# EAGLE design Adafruit CC3000 shield REV-B (EAGLE 6.3)
COMPANY: ADAFRUIT INDUSTRIES; DRAWN: KTOWN; REV: C
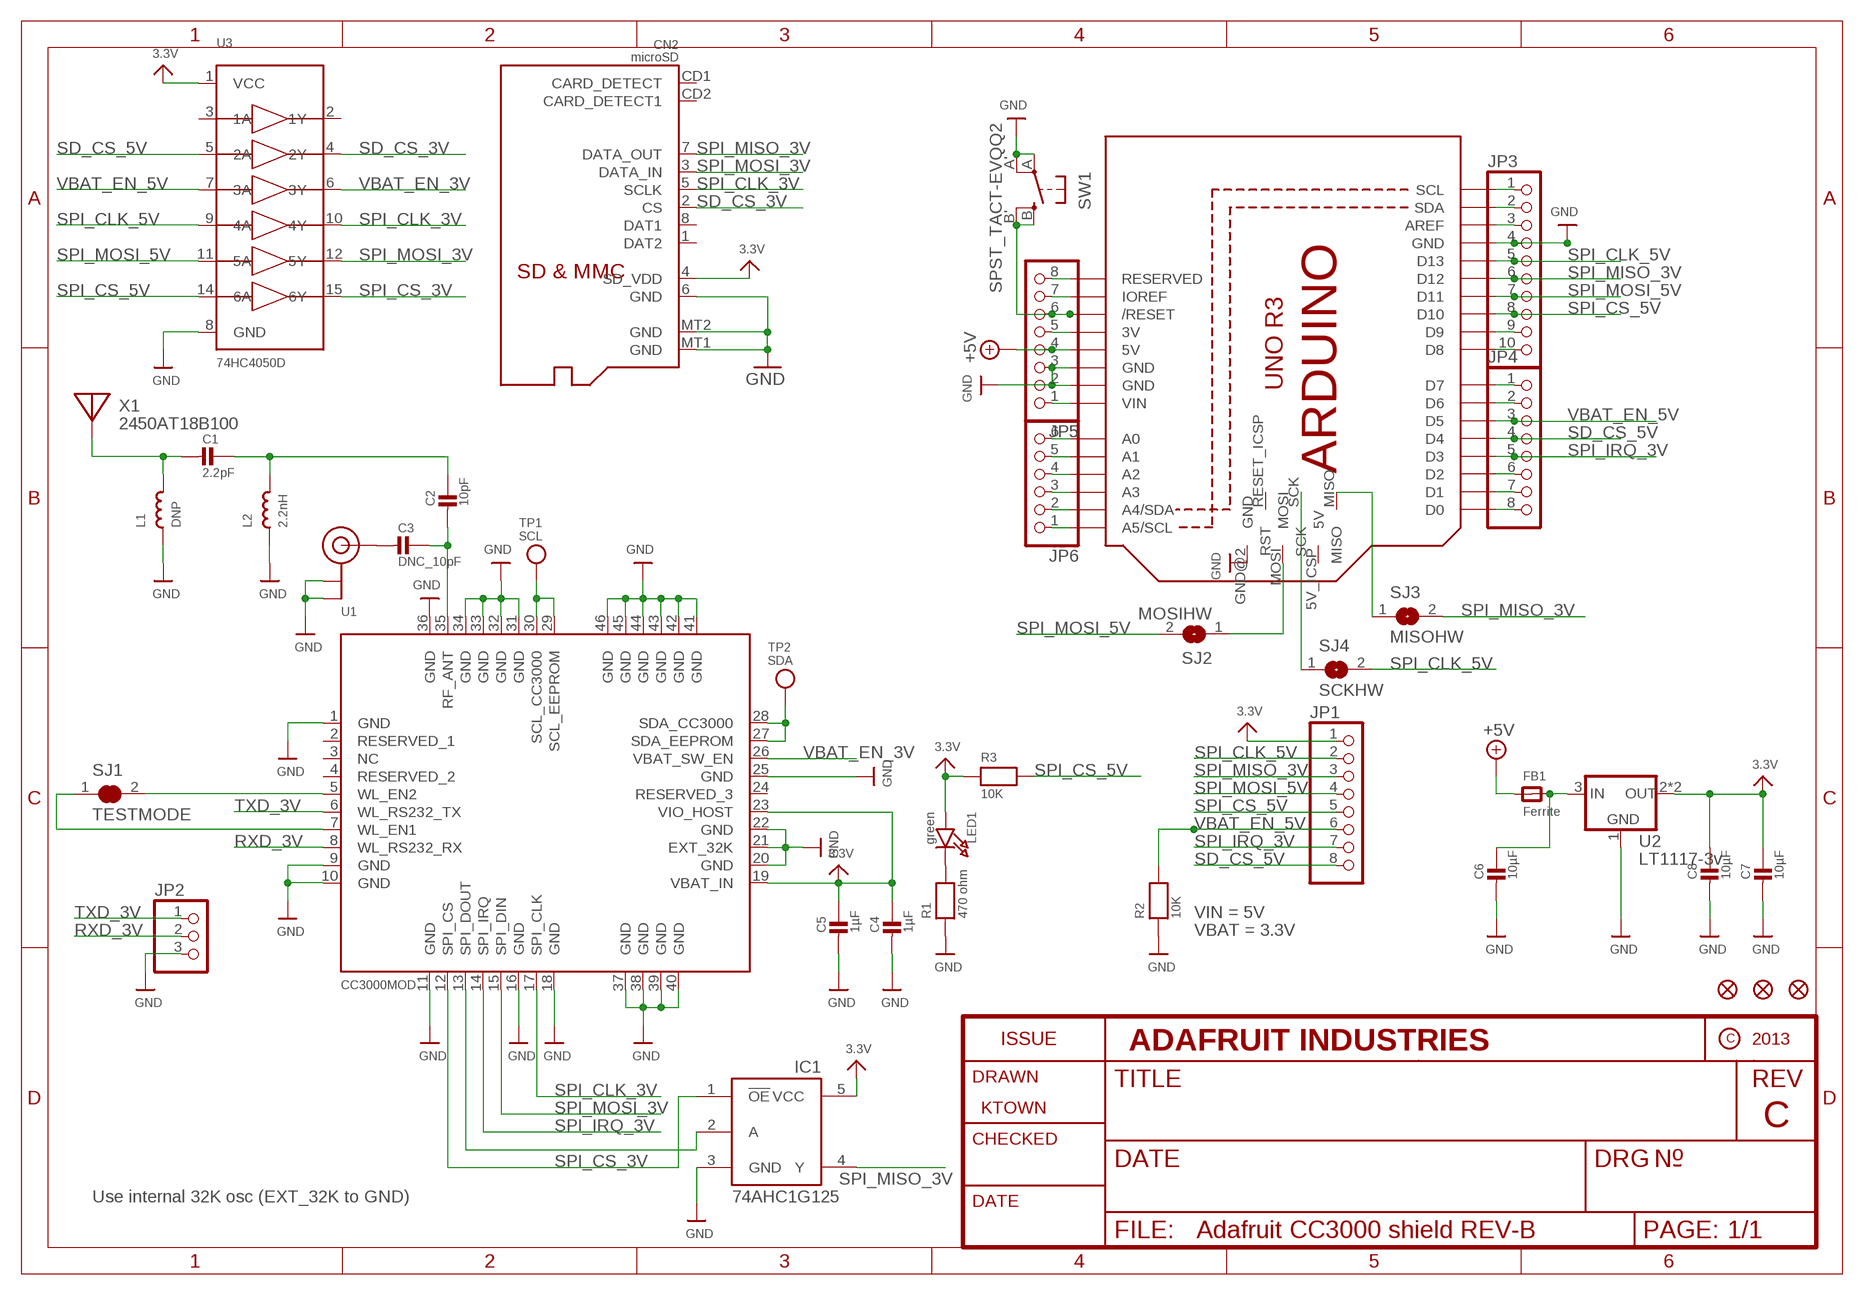
[diagram p0: schematic, sheet 1]

## Parts
C1  2.2pF  CAP_CERAMIC_0402  [_0402]
C2  10pF  CAP_CERAMIC_0402  [_0402]
C3  DNC_10pF  CAP_CERAMIC_0402  [_0402]
C4  1µF  CAP_CERAMIC_0805MP  [_0805MP]
C5  1µF  CAP_CERAMIC_0805MP  [_0805MP]
C6  10µF  CAP_CERAMIC_0805MP  [_0805MP]
C7  10µF  CAP_CERAMIC_0805MP  [_0805MP]
C8  10µF  CAP_CERAMIC_0805MP  [_0805MP]
CN2  microSD  MICROSD  [MICROSD]
FB1  Ferrite  FERRITE_0805MP  [_0805MP]
FID1  FIDUCIAL""  [FIDUCIAL_1MM]
FID2  FIDUCIAL""  [FIDUCIAL_1MM]
FID3  FIDUCIAL""  [FIDUCIAL_1MM]
IC1  74AHC1G125  [SOT23-5L]
JP1  PINHD-1X8BIG  [1X08-BIG]
JP2  HEADER-1X3ROUND  [1X03_ROUND]
JP3  HEADER-1X1070MIL  [1X10_ROUND70]
JP4  PINHD-1X8CLEANBIG  [1X08-CLEANBIG]
JP5  PINHD-1X8CLEANBIG  [1X08-CLEANBIG]
JP6  PINHD-1X6CB  [1X06-CLEANBIG]
L1  DNP  INDUCTOR_0402  [_0402]
L2  2.2nH  INDUCTOR_0402  [_0402]
LED1  green  LED0805_NOOUTLINE  [CHIPLED_0805_NOOUTLINE]
R1  470 ohm  RESISTOR_0805MP  [_0805MP]
R2  10K  RESISTOR_0805MP  [_0805MP]
R3  10K  RESISTOR_0805MP  [_0805MP]
SJ1  TESTMODE  SOLDERJUMPER_CLOSED  [SOLDERJUMPER_CLOSEDWIRE]
SJ2  MOSIHW  SOLDERJUMPER  [SOLDERJUMPER_ARROW_NOPASTE]
SJ3  MISOHW  SOLDERJUMPER  [SOLDERJUMPER_ARROW_NOPASTE]
SJ4  SCKHW  SOLDERJUMPER  [SOLDERJUMPER_ARROW_NOPASTE]
SW1  SPST_TACT-EVQQ2  [EVQ-Q2]
TP1  SCL  TESTPOINTPAD1MM  [TESTPOINT_PAD_1MM]
TP2  SDA  TESTPOINTPAD1MM  [TESTPOINT_PAD_1MM]
U1  CC3000MOD  [CC3000MOD]
U2  LT1117-3v  VREG_SOT223  [SOT223-R]
U3  74HC4050D  [SOIC16]
U$35  U.FL  [U.FL]
U$36  ARDUINO_R3_ICSP  [ARDUINOR3_ICSP]
X1  2450AT18B100  ANTENNA_JOHANSON_2500AT44M0400  [ANT_2500AT44M0400]

## Nets
3.3V: C4.1 C5.1 C7.1 C8.1 CN2.4(SD_VDD) IC1.5(VCC) JP1.1 LED1.A R3.1 U1.19(VBAT_IN) U1.23(VIO_HOST) U2.2(OUT) U2.4(OUT) U3.1(VCC)
+5V: FB1.1 JP5.4 U$36.5V
GND: C4.2 C5.2 C6.2 C7.2 C8.2 CN2.6(GND) CN2.MT1(GND) CN2.MT2(GND) IC1.3(GND) JP2.3 JP3.4 JP5.2 JP5.3 L1.1 L2.1 R1.1 R2.1 SW1.A'(P1) SW1.A(P) U1.1(GND) U1.9(GND) U1.10(GND) U1.11(GND) U1.16(GND) U1.18(GND) U1.20(GND) U1.21(EXT_32K) U1.22(GND) U1.25(GND) U1.31(GND) U1.32(GND) U1.33(GND) U1.34(GND) U1.36(GND) U1.37(GND) U1.38(GND) U1.39(GND) U1.40(GND) U1.41(GND) U1.42(GND) U1.43(GND) U1.44(GND) U1.45(GND) U1.46(GND) U2.1(GND) U3.8(GND) U$35.P$1(GND) U$35.P$2(GND) U$36.GND U$36.GND@1(GND) U$36.GND@2(GND) U$36.GND@3(GND)
N$1: C1.2 L1.2 X1.FEED
N$2: C1.1 C2.1 L2.2
N$3: C3.2 U$35.P$3(SIGNAL)
N$4: C2.2 C3.1 U1.35(RF_ANT)
N$5: SJ1.2 U1.5(WL_EN2)
N$6: SJ1.1 U1.7(WL_EN1)
N$7: JP3.1 U$36.SCL
N$8: JP3.2 U$36.SDA
N$9: C6.1 FB1.2 U2.3(IN)
N$10: JP3.3 U$36.AREF
N$11: JP5.6 SW1.B'(S1) SW1.B(S) U$36.RESET(/RESET)
N$12: IC1.2(A) U1.13(SPI_DOUT)
N$16: JP3.9 U$36.D9
N$17: JP3.10 U$36.D8
N$18: JP4.1 U$36.D7
N$19: JP4.2 U$36.D6
N$23: JP4.6 U$36.D2
N$24: JP4.7 U$36.D1
N$25: JP4.8 U$36.D0
N$26: JP5.1 U$36.VIN
N$27: JP5.5 U$36.3V
N$29: JP5.7 U$36.IOREF
N$30: JP5.8 U$36.RESERVED
N$31: JP6.1 U$36.A5(A5/SCL)
N$32: JP6.2 U$36.A4(A4/SDA)
N$33: JP6.3 U$36.A3
N$34: JP6.4 U$36.A2
N$35: JP6.5 U$36.A1
N$36: JP6.6 U$36.A0
N$53: LED1.C R1.2
N$161: SJ2.1 U$36.MOSI
N$163: SJ4.1 U$36.SCK
N$164: SJ3.1 U$36.MISO
RXD_3V: JP2.2 U1.8(WL_RS232_RX)
SCL_3V: TP1.P$1 U1.29(SCL_EEPROM) U1.30(SCL_CC3000)
SD_CS_3V: CN2.2(CS) U3.4(2Y)
SD_CS_5V: JP1.8 JP4.4 U3.5(2A) U$36.D4
SDA_3V: TP2.P$1 U1.27(SDA_EEPROM) U1.28(SDA_CC3000)
SPI_CLK_3V: CN2.5(SCLK) U1.17(SPI_CLK) U3.10(4Y)
SPI_CLK_5V: JP1.2 JP3.5 SJ4.2 U3.9(4A) U$36.D13
SPI_CS_3V: IC1.1(!OE) U1.12(SPI_CS) U3.15(6Y)
SPI_CS_5V: JP1.5 JP3.8 R3.2 U3.14(6A) U$36.D10
SPI_IRQ_3V: JP1.7 JP4.5 U1.14(SPI_IRQ) U$36.D3
SPI_MISO_3V: CN2.7(DATA_OUT) IC1.4(Y) JP1.3 JP3.6 SJ3.2 U$36.D12
SPI_MOSI_3V: CN2.3(DATA_IN) U1.15(SPI_DIN) U3.12(5Y)
SPI_MOSI_5V: JP1.4 JP3.7 SJ2.2 U3.11(5A) U$36.D11
TXD_3V: JP2.1 U1.6(WL_RS232_TX)
VBAT_EN_3V: U1.26(VBAT_SW_EN) U3.6(3Y)
VBAT_EN_5V: JP1.6 JP4.3 R2.2 U3.7(3A) U$36.D5
Unconnected: CN2.1(DAT2) CN2.8(DAT1) CN2.CD1(CARD_DETECT) CN2.CD2(CARD_DETECT1) U1.2(RESERVED_1) U1.3(NC) U1.4(RESERVED_2) U1.24(RESERVED_3) U3.2(1Y) U3.3(1A) U$36.5V_ICSP(5V) U$36.RESET_ICSP(RST)

## Notes on the sheet
- VIN = 5V
- VBAT = 3.3V
- Use internal 32K osc (EXT_32K to GND)

## Library data of the parts
C1-C8 = microbuilder:CAP_CERAMIC: Ceramic Capacitors For new designs, use the packages preceded by an '_' character since they are more reliable: The following footprints should be used on most boards: _0402 - Standard footprint for regular board layouts _0603 - Standard footprint for regular board layouts _0805 - Standard footprint for regular board layouts For extremely tight-pitch boards where space is at a premium, the following 'micro-pitch' footprints can be used (smaller pads, no silkscreen outline, etc.): _0402MP - Micro-pitch footprint for very dense/compact boards _0603MP - Micro-pitch footprint for very dense/compact boards _0805MP - Micro-pitch footprint for very dense/compact boards Commonly Stocked Parts 0402 - 0402 Surface Mount Capacitors 16pF 50V 5% [Digikey: 445-4899-2-ND] 18pF 50V 5% [Digikey: 490-1281-2-ND] 22pF 50V 5% [Digikey: 490-1283-2-ND] 68pF 50V 5% [Digikey: 490-1289-2-ND] 0.1uF 10V 10% [Digikey: 490-1318-2-ND] 1.0uF 6.3V 10% [Digikey: 490-1320-2-ND] 0603 - 0603 Surface Mount Capacitors 16 pF 50V 5% [Digikey: 445-5051-2-ND] 22 pF 50V [Digikey: PCC220ACVTR-ND] 33 pF 50V 5% [Digikey: 490-1415-1-ND] 56pF 50V 5% [Digikey: 490-1421-1-ND] 220pF 50V 5% [Digikey: 445-1285-1-ND] 680 pF 50V 2200 pF 50V 5% C0G [Digikey: 445-1297-1-ND] 5600 pF 100V 5% X7R [Digikey: 478-3711-1-ND] 0.1 µF 25V 10% [Digikey: PCC2277TR-ND] 0.22 µF 16V 10% X7R [Digikey: 445-1318-1-ND] 1.0 µF 25V 10% [Digikey: 445-5146-2-ND] 0603 - RF Specific 3pF 250V +/-0.1pF RF [Digikey: 712-1347-1-ND] 18 pF 250V 5% [Digikey: 478-3505-1-ND or 712-1322-1-ND] 56 pF 250V 5% C0G RF [Digikey: 490-4867-1-ND] 68 pF 250V RF [Digikey: 490-4868-1-ND] 0805 - 0805 Surface Mount Capacitors 220 pF 250V 2% RF Ceramic Capacitor [Digikey: 712-1398-1-ND] 1000 pF 50V 2% NP0 Ceramic Capacitor [Digikey: 478-3760-1-ND] 0.1 µF 25V 10% Ceramic Capacitor [Digikey: PCC1828TR-ND] 1.0 µF 16V 10% Ceramic Capacitor[Digikey: 490-1691-2-ND] 10.0 µF 10V 10% Ceramic Capacitor[Digikey: 709-1228-1-ND] 10.0 uF 16V 10% Ceramic Capacitor [Digikey: 478-5165-2-ND] 47 uF 6.3V 20% Ceramic Capacitor [Digikey: 587-1779-1-ND or 399-5506-1-ND] 1206 - 1206 Surface Mount Capacitors 47uF 10V 20% Ceramic Capacitor [Digikey: 490-5528-1-ND or 399-5508-1-ND or 445-6010-1-ND] 100uF 6.3V -20%, +80% Y5V Ceramic Capacitor (Digikey: 490-4512-1-ND, Mouser: 81-GRM31CF50J107ZE1L)
CN2 = microbuilder:MICROSD: MicroSD/Transflash Card Holder with SPI pinout 3M: 2908-05WB-MG 4UConnector: 19656 Footprint courtesy: Adafruit Industries
FB1 = microbuilder:FERRITE: Ferrite Bead 0603 MMZ1608B121C - 120 Ohm @ 100MHz, 600mA, 0.15 Ohm DC Resistance - Digikey: 445-2164-1-ND BK1608HW121-T - 120 Ohm, 600mA Ferrite Chip - Digikey: 587-1876-2-ND 0805 HZ0805B272R-10 - 2.7K Ohm @ 100MHz, 200mA, 0.8 Ohm DC Resistance - Digikey: 240-2504-1-ND (see also Murata BLM21BD272SN1L) MMZ2012Y152B - 1.5K Ohm @ 100MHz, 500mA, 0.4 Ohm DC Resistance - Digikey: 445-1560-1-ND - Mainly for high frequency (80-400MHz) MMZ2012R102A - 1K Ohm @ 100MHz, 500mA, 0.3 Ohm DC Resistance - Digikey: 445-1555-2-ND - More general purpose (10-200MHz)
FID1-FID3 = microbuilder:FIDUCIAL: Fiducial Alignment Points Various fiducial points for machine vision alignment.; BOM: EXCLUDE
IC1 = adafruit:74AHC1G125
JP1 JP4 JP5 = adafruit:PINHD-1X8: PIN HEADER
JP2 = microbuilder:HEADER-1X3: PIN HEADER
JP3 = microbuilder:HEADER-1X10: PIN HEADER
JP6 = adafruit:PINHD-1X6: PIN HEADER
L1 L2 = microbuilder:INDUCTOR: Inductors 0603: 10nH Ceramic Inductor - microwire antenna/RF (Digikey: 712-1434-2-ND) 0805: 560nH Ceramic Inductor - RF (Digikey: 553-1047-1-ND) 270nH Ceramic Inductor - Q = 40@250MHz, +-5%, 1 Ohm DC Resistance (Digikey: 535-10506-2-ND) 1007 (2518 Metric) SMT: 10µH 10% 250mOhm 820mA 1007 Inductor (Digikey: 587-2189-1-ND) 22µH 10% 500mOhm 580mA 1007 Inductor (Digikey: 587-2190-1-ND) 47µH 10% 950mOhm 420mA 1007 Inductor (Digikey: 587-2191-1-ND) 47µH 5% 100mOhm 1A 1008 Inductor (Digikey: 732-1816-1-ND) 5.0x5.0mm (Taiyo Yuden NR5040 Series) 6.8µH 20% 2.3A 64mOhm Inductor (Digikey: 587-2374-2-ND) 5.0x5.0mm (TDK VLC5045 Series) 4.7µH 20% 3.3A 34mOhm Inductor (Digikey: 445-6526-1-ND) 6.8µH 20% 2.7A 46mOhm Inductor (Digikey: 445-6527-1-ND) 6.0x6.0mm (TDK VLC6045 Series) 4.7µH 20% 3.8A 27mOhm Inductor (Digikey: 445-6538-2-ND) 6.8µH 20% 3A 41mOhm Inductor (Digikey: 445-6540-1-ND) 6.2µH 30% 2.2A 45mOhm Inductor (Digikey: SRR5028-6R2YCT-ND) - Not TDK VLC6045 but footprint should match 6.0x6.0mm (TDK SLF6045 Series) 6.8uH 30% 2A 33mOhm Inductor (Digikey: 445-4572-1-ND, Mouser: 810-SLF645T6R8N2R0PF) 6.0x6.0mm (Sumida CDRH5D28 Series) 6.2uH 30% 1.8A 45mOhm Inductor (Digikey: 308-1542-1-ND) Taiyo Yuden NR3015T2R2M - 2.2uH 20% 1.5A (Digikey: 587-1648-2-ND, Mouser: 963-NR3015T2R2M) - Used with TI TPS62172 CoilCraft RFID Transponder Coil - MA5532-AE (For use with AS3935 Lightning Sensor)
LED1 = microbuilder:LED: LED 0603 - 0603 Surface Mount Package 2mA: Green LED - Low Power (3.9mcd, 2ma, 1.7Vf) - Digikey: 475-2709-2-ND Orange LED - Low Power (9.8mcd, 2ma, 1.8Vf) - Digikey: 475-1194-2-ND Red LED - Low Power (5mcd, 2ma, 1.8Vf) - Digikey: 475-1195-2-ND Yellow LED - Low Power (7mcd, 2ma, 1.8Vf) - Digikey: 475-1196-2-ND 5mA: Blue LED - Low Power (17mcd, 5ma, 2.9Vf) - Digikey: LNJ937W8CRACT-ND 0805 - 0805 Surface Mount Package 2mA: Red LED (8.8mcd, 2mA, 1.8Vf, Clear) - Low Power [Digikey: 475-2510-1-ND] Green LED (5mcd, 2mA, 1.8Vf, Clear) - Low Power [Digikey: 475-2730-1-ND] Yellow LED (11.3mcd, 2mA, 1.8Vf, Clear) - Low Power [Digikey: 475-2555-1-ND] 20mA: Red LED (104mcd, 20mA, Diffused) - LS R976 [Digikey: 475-1278-6-ND] Red LED (12mcd, 20mA, 2.0Vf, Clear) - APT2012EC [Digikey: 754-1128-1-ND] Green LED (15mcd, 20mA, 2.2Vf, Clear) - APT2012GC [Digikey: 754-1131-1-ND] Orange LED (160mcd, 20mA, 2.1Vf, Clear) - APT2012SECK [Digikey: 754-1130-1-ND] 1206 - 1206 Surface Mount Package Green LED (26mcd, 20mA, Diffused) - LG N971 [Digikey: 475-1407-6-ND] Red LED (15mcd, 20mA, Diffused) - LH N974 [Digikey: 475-1416-6-ND] Cree - Cree High-Power Surface Mount LEDs XPEBWT-L1-0000-00D50 - White 111lm 350mA 2.9Vf 6200K 110° XTEAWT-00-0000-00000LEE3 - White 114lm 350mA 2.85Vf 5000K 115° Everlight - Everlight 45-21 Series Surface Mount LEDs 45-21/QK2C-B2832AC2CB2/2T - Warm White 2000mcd 20mA 3.25Vf 3050K 120° 45-21/LK2C-B38452C4CB2/2T - Nuetral White 2000mcd 20mA 3.25Vf 4150K 120° 45-21/LK2C-B50634C6CB2/2T - Cold White 2200mcd 20mA 3.25Vf 5650K 120° PLCC2 Reverse Mount LS T77K-J1L2-1-0-2-R18-Z - Red 11.25mcd 2mA 1.8Vf 630nm 120° LO T77K-L1M2-24-Z - Orange 19.6mcd 2mA 1.8Vf 606nm 120° LY T77K-K2M1-26-Z - Yellow 15.7mcd 2mA 1.8Vf 587nm 120°
R1-R3 = microbuilder:RESISTOR: Resistors For new designs, use the packages preceded by an '_' character since they are more reliable: The following footprints should be used on most boards: _0402 - Standard footprint for regular board layouts _0603 - Standard footprint for regular board layouts _0805 - Standard footprint for regular board layouts For extremely tight-pitch boards where space is at a premium, the following 'micro-pitch' footprints can be used (smaller pads, no silkscreen outline, etc.): _0402MP - Micro-pitch footprint for very dense/compact boards _0603MP - Micro-pitch footprint for very dense/compact boards _0805MP - Micro-pitch footprint for very dense/compact boards
SJ1 = microbuilder:SOLDERJUMPER_CLOSED: Solder Jumper - Closed These solder jumpers are closed by default CLOSEDWIRE - 10 mil trace between pads that can be cut and resoldered later CLOSEDPERM - 63 mil trace between pads for a permanent connection (used to 'bridge' two signals, a shameless hack for Eagle). Can double as a test point as well (no cream layer)
SJ2-SJ4 = microbuilder:SOLDERJUMPER: SMD Solder JUMPER Solder the two pads together to create a connection, or remove the solder to break it. REFLOW - Use this footprint for solder paste and reflow ovens. WAVE - Use this footprint for hand-soldering (larger pads). CLOSED - Has a trace between the two pads to ensure it is closed by default. The trace needs to be cut to disable the jumper, and can be closed again by creating a solder bridge between the two pads.; BOM: EXCLUDE
SW1 = adafruit:SPST_TACT: SMT 6mm switch, EVQQ2 series http://www.ladyada.net/library/eagle
TP1 TP2 = microbuilder:TESTPOINT: Test Point Various test points for characterisation and PCB testing TESTPOINT_SMT - Compact Surface Mount Test Point [Digikey: 5016KTR-ND]
U1 = microbuilder:CC3000MOD: CC3000MOD Wifi Module
U2 = microbuilder:VREG_SOT223: SOT-223 Fixed Voltage Regulators Part Current Out V Out V In V Dropout θJA (°C/W) TJ (°C) Operating Temp Digikey Part No. AP1117 1A 3.3V 18V 1.1V@500mA, 1.3V@1A 107°C/W 150°C -40°C-125°C AP1117IE33G-13DICT-ND Max operating temp can be calculated using θJA, TJ (max junction temperature), and power in watts. Set the "Maximum Ambient Temperature" until it reaches TJ ("Max Junction Temperature"), which is the absolute limit for safe use of the regulator: Heat Sink Temperature Calculator <http://www.daycounter.com/Calculators/Heat-Sink-Temperature-Calculator.phtml> For example, With 12V source into a 3.3V LP2985 and a 30mA load, we are dissipating (12V-3.3V) * 0.03A = 0.261W. With a θJA of 206 °C/W, a TJ of 150°C, and 261mW we can safely use the chip without a heat sink up to 75°C (=147.1°C Junction Temperature).
U3 = microbuilder:74HC4050D: 6-channel level shifter 74HC4050D - 2V-6V Supply SOIC16 Digikey: 74HC4050D,653-ND Mouser: 771-74HC4050D-T TSSOP16 Digikey: 296-9215-1-ND Mouser:
U$35 = microbuilder:U.FL: U.FL Antenna Connector
U$36 = adafruit:ARDUINO_R3_ICSP
X1 = microbuilder:ANTENNA_JOHANSON_2500AT44M0400: Johanson 2.3-2.7 GHz Chip Antenna Frequency Range: 2400 - 2500 Mhz Peak Gain 2.5 dBi typ. (XZ-V) Average Gain 0.5 dBi typ. (XZ-V) Input Power 3W max. Operating Temperature -40 to +85°C Digikey: 712-1403-1-ND Mouser: 609-2500AT44M0400E

## Board
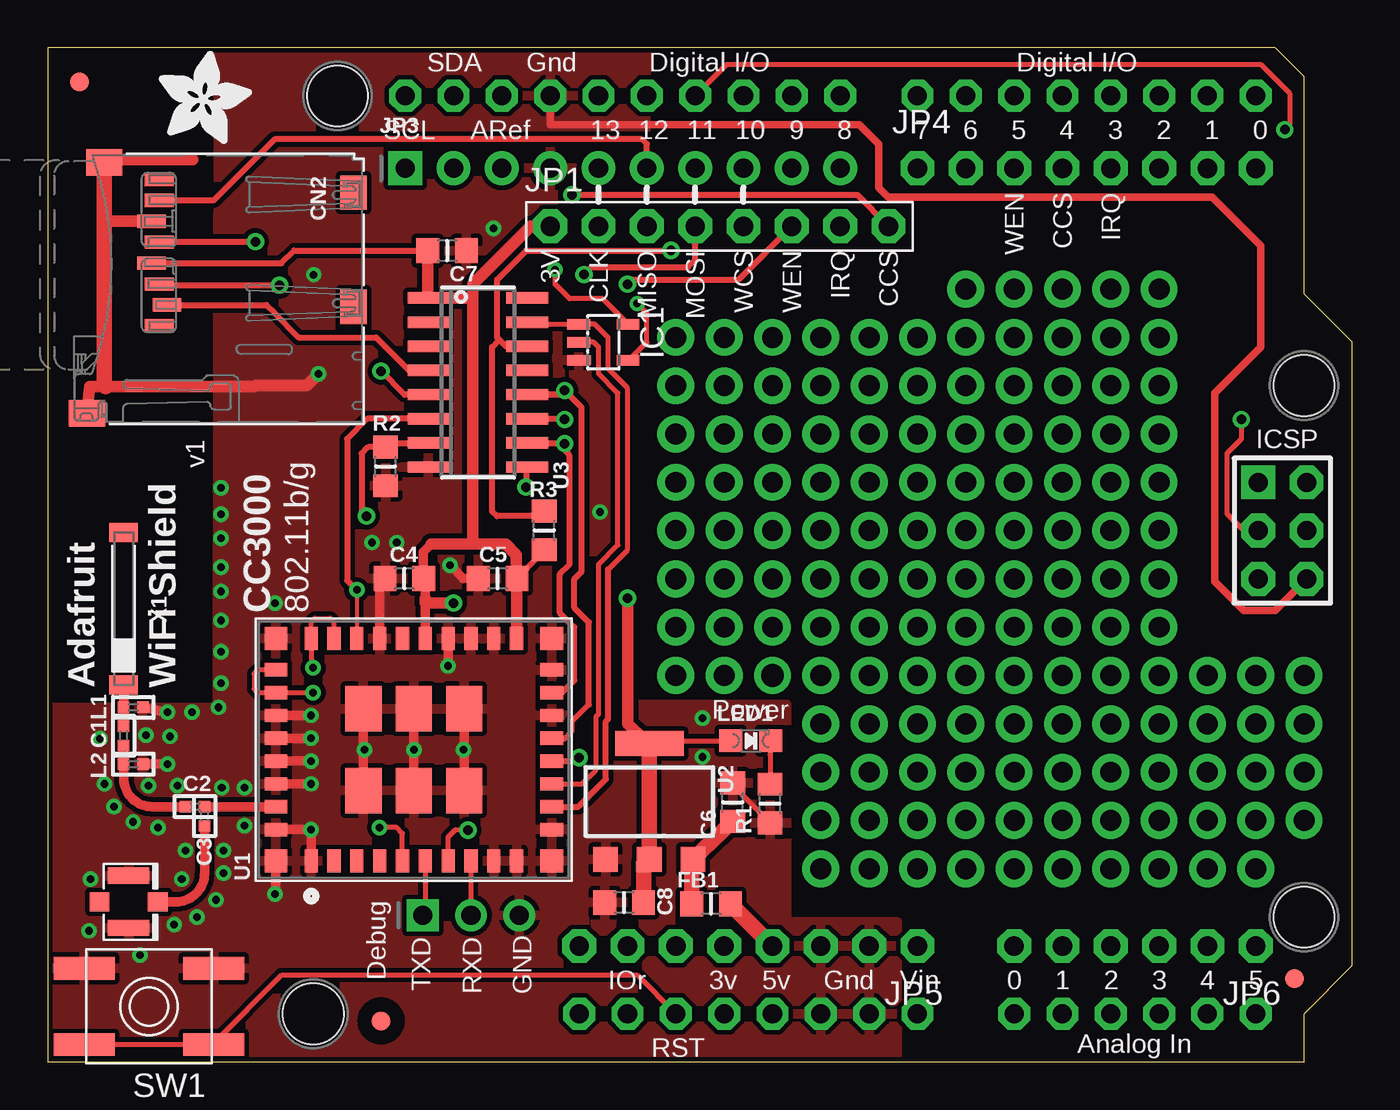
[diagram p1: board, top side]
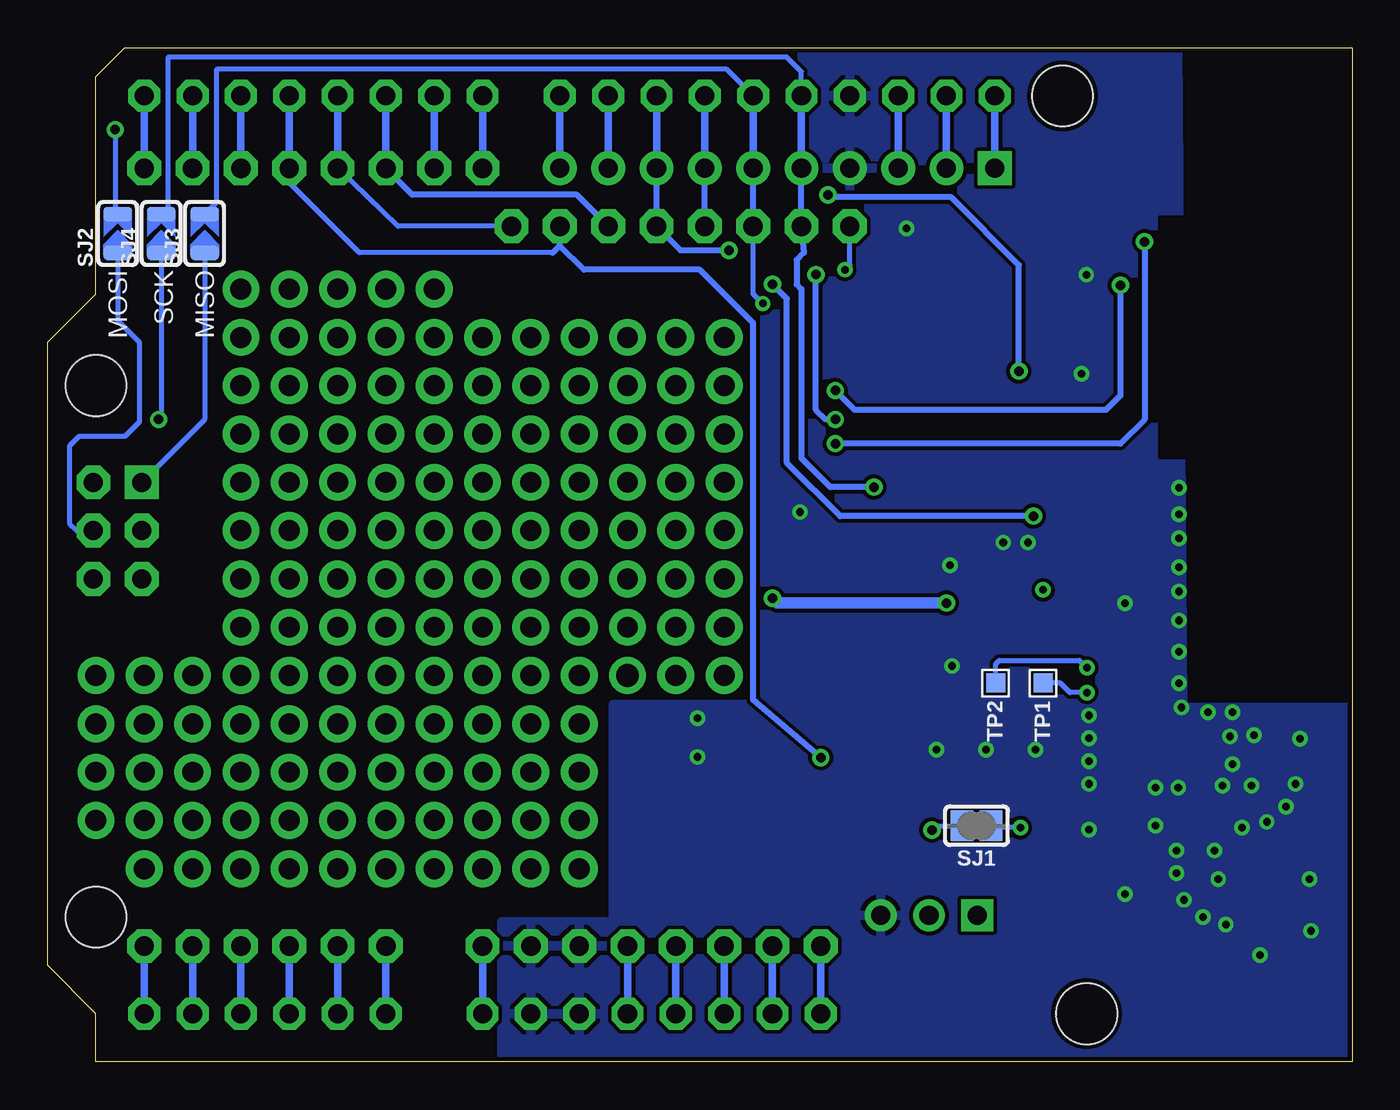
[diagram p2: board, bottom side, seen from below]

Size 68.58 x 53.34 mm. Coordinates in mm from the lower left corner, seen from the top.
Copper layers (1*16): Top 0.035mm / dielectric 1.5mm / Bottom 0.035mm
Design rules "adafruit": minimum track width 8mil, minimum drill 15.5mil, track to track 8mil, track to pad 8mil, pad to pad 8mil, via to via 8mil, smd to smd 8mil, copper to edge 10mil, drill to drill 8mil, minimum pad ring 10mil, minimum via ring 8mil, stop-mask expansion 4mil, vias tented up to drill 20mil, thermal gap 10mil
Holes 3.2 mm at 15.24,50.8 13.97,2.54 66.04,7.62 66.04,35.56

### Footprints (pad centres in the part's own frame; a part is rotated, then mirrored left to right if it is on the bottom)
_0402 = smd 0.6 x 0.6: 1 -0.508,0; 2 0.508,0
_0805MP = smd 1.2 x 1.3: 1 -1.016,0; 2 1.016,0
MICROSD = smd 0.7 x 1.5: 1 9,-10.64; 2 7.9,-10.24; 3 6.8,-10.64; 4 5.7,-11.04; 5 4.6,-10.64; 6 3.5,-11.04; 7 2.4,-10.64; 8 1.3,-10.64 | smd 1.8 x 1.4: CD1 2,-0.44; CD2 8,-0.44 | smd 1.4 x 1.9: MT1 0.4,-13.54; MT2 13.6,-14.44
FIDUCIAL_1MM = smd 1 x 1: 1 0,0
SOT23-5L = smd 0.55 x 1.2: 1 -0.95,-1.3; 2 0,-1.3; 3 0.95,-1.3; 4 0.95,1.3; 5 -0.95,1.3
1X08-BIG = drill 1.016 pad 1.778 octagon: 1 -8.89,0; 2 -6.35,0; 3 -3.81,0; 4 -1.27,0; 5 1.27,0; 6 3.81,0; 7 6.35,0; 8 8.89,0
1X03_ROUND = drill 1 pad 1.676 square: 1 -2.54,0 | drill 1 pad 1.676: 2 0,0; 3 2.54,0
1X10_ROUND70 = drill 1 pad 1.778 square: 1 -11.43,0 | drill 1 pad 1.778: 2 -8.89,0; 3 -6.35,0; 4 -3.81,0; 5 -1.27,0; 6 1.27,0; 7 3.81,0; 8 6.35,0; 9 8.89,0; 10 11.43,0
1X08-CLEANBIG = drill 1.016 pad 1.778 octagon: 1 -8.89,0; 2 -6.35,0; 3 -3.81,0; 4 -1.27,0; 5 1.27,0; 6 3.81,0; 7 6.35,0; 8 8.89,0
1X06-CLEANBIG = drill 1.016 pad 1.778 octagon: 1 -6.35,0; 2 -3.81,0; 3 -1.27,0; 4 1.27,0; 5 3.81,0; 6 6.35,0
CHIPLED_0805_NOOUTLINE = smd 1.2 x 1.2: A 0,-1.05; C 0,1.05
SOLDERJUMPER_CLOSEDWIRE = smd 1.168 x 1.6: 1 -0.762,0; 2 0.762,0 | smd 0.635 x 0.203: WIRE 0,0
SOLDERJUMPER_ARROW_NOPASTE = smd 0.762 x 1.524: 1 -1.016,0; 2 1.016,0
EVQ-Q2 = smd 3.2 x 1.2: A -3.4,-2; A' 3.4,-2; B -3.4,2; B' 3.4,2
TESTPOINT_PAD_1MM = smd 1 x 1: P$1 0,0
CC3000MOD = smd 1.2 x 0.7: 1 -5.85,5.4; 2 -5.85,4.2; 3 -5.85,3; 4 -5.85,1.8; 5 -5.85,0.6; 6 -5.85,-0.6; 7 -5.85,-1.8; 8 -5.85,-3; 9 -5.85,-4.2; 10 -5.85,-5.4; 19 5.85,-5.4; 20 5.85,-4.2; 21 5.85,-3; 22 5.85,-1.8; 23 5.85,-0.6; 24 5.85,0.6; 25 5.85,1.8; 26 5.85,3; 27 5.85,4.2; 28 5.85,5.4 | smd 0.7 x 1.2: 11 -4.2,-7.25; 12 -3,-7.25; 13 -1.8,-7.25; 14 -0.6,-7.25; 15 0.6,-7.25; 16 1.8,-7.25; 17 3,-7.25; 18 4.2,-7.25; 29 4.2,7.25; 30 3,7.25; 31 1.8,7.25; 32 0.6,7.25; 33 -0.6,7.25; 34 -1.8,7.25; 35 -3,7.25; 36 -4.2,7.25 | smd 2.4 x 1.9: 37 -2.15,2.65; 38 -2.15,0; 39 -2.15,-2.65; 40 2.15,2.65; 41 2.15,0; 42 2.15,-2.65 | smd 1.2 x 1.2: 43 -5.85,7.25; 44 -5.85,-7.25; 45 5.85,-7.25; 46 5.85,7.25
SOT223-R = smd 1.3 x 1.3: 1 -2.3,-3.05; 2 0,-3.05; 3 2.3,-3.05 | smd 3.6 x 1.3: 4 0,3.05
SOIC16 = smd 0.6 x 2.2: 1 -4.445,-2.6; 2 -3.175,-2.6; 3 -1.905,-2.6; 4 -0.635,-2.6; 5 0.635,-2.6; 6 1.905,-2.6; 7 3.175,-2.6; 8 4.445,-2.6; 9 4.445,2.6; 10 3.175,2.6; 11 1.905,2.6; 12 0.635,2.6; 13 -0.635,2.6; 14 -1.905,2.6; 15 -3.175,2.6; 16 -4.445,2.6
U.FL = smd 2.2 x 0.85: P$1 0,1.375; P$2 0,-1.375 | smd 1.05 x 1: P$3 1.525,0; P$4 -1.525,0
ARDUINOR3_ICSP = drill 1 pad 1.676 octagon: 3V 35.56,2.54; 5V 38.1,2.54; A0 50.8,2.54; A1 53.34,2.54; A2 55.88,2.54; A3 58.42,2.54; A4 60.96,2.54; A5 63.5,2.54; AREF 23.876,50.8; D0 63.5,50.8; D1 60.96,50.8; D2 58.42,50.8; D3 55.88,50.8; D4 53.34,50.8; D5 50.8,50.8; D6 48.26,50.8; D7 45.72,50.8; D8 41.656,50.8; D9 39.116,50.8; D10 36.576,50.8; D11 34.036,50.8; D12 31.496,50.8; D13 28.956,50.8; GND 26.416,50.8; GND@1 43.18,2.54; GND@2 40.64,2.54; IOREF 30.48,2.54; RESERVED 27.94,2.54; RESET 33.02,2.54; SCL 18.796,50.8; SDA 21.336,50.8; VIN 45.72,2.54 | drill 1 pad 1.778 octagon: 5V_ICSP 66.167,30.48; GND@3 66.167,25.4; MOSI 66.167,27.94; RESET_ICSP 63.627,25.4; SCK 63.627,27.94 | drill 1 pad 1.778 square: MISO 63.627,30.48
ANT_2500AT44M0400 = smd 1 x 1.5: FEED 4,0; NC -4,0

### Placement (x,y rotation side)
C1  4,17.15 90 top
C2  7.75,13.42 0 top
C3  8.25,12.92 270 top
C4  18.75,25.42 180 top
C5  23.65,25.42 180 top
C6  36.01,13.66 90 top
C7  21,42.67 0 top
C8  30.31,8.38 180 top
CN2  16.51,47.7 270 top
FB1  34.88,8.32 180 top
FID1  1.67,51.52 90 top
FID2  65.55,4.39 90 top
FID3  17.53,2.16 0 top
IC1  29.21,37.85 270 top
JP1  35.31,43.94 0 top
JP2  22.25,7.71 0 top
JP3  30.23,46.99 0 top
JP4  54.61,46.99 0 top
JP5  36.83,6.1 180 top
JP6  57.15,6.1 180 top
L1  4.5,18.65 180 top
L2  4.5,15.66 180 top
LED1  36.96,16.89 270 top
R1  37.97,13.59 90 top
R2  17.76,31.32 90 top
R3  26.1,27.95 90 top
SJ1  19.75,12.42 0 bottom
SJ2  64.9,43.56 90 bottom
SJ3  60.33,43.56 90 bottom
SJ4  62.61,43.56 90 bottom
SW1  5.33,2.92 180 top
TP1  16.25,19.92 270 bottom
TP2  18.75,19.92 270 bottom
U1  19.25,16.42 90 top
U2  31.63,13.7 0 top
U3  22.62,35.73 270 top
U$8  [ADAFRUIT_5MM]  5.86,48.29 0 top
U$35  4.25,8.42 0 top
U$36  0,0 0 top
X1  3.99,23.83 270 top

### Tracks (layer width: path | path; a pad name or v marks a point on that pad's centre or on a via)
3.3V  (via drill 0.39, 0.5)
  Top 0.254: IC1.5 29.17,40.13 27.43,40.13 26.67,40.89 v26.67,41.66 | U2.4 31.77,16.89 LED1.A
  Top 0.305: R3.1 24.69,25.41 C5.1 | CN2.4 12.29,42 12.95,42.67 C7.1
  Top 0.5: 20.15,27.22 19.75,26.82 19.75,25.44 C4.1 19.85,25.34 19.85,24.38 U1.23
  Top 0.61: U1.19 24.65,25.41 C5.1 24.64,25.46 24.64,26.67 24.08,27.22 22.35,27.22 | 20.15,27.22 22.35,27.22 | U2.4 30.48,17.77 v30.48,24.38 | v21.34,24.13 19.85,24.13 19.85,24.38 | C7.1 19.98,40.2 U3.1 | 19.91,40.27 U3.1 | U3.1 22.35,40.17 | 22.35,40.17 22.35,27.22 | JP1.1 25.4,43.94 22.35,40.89 22.35,40.17
  Top 0.813: C8.1 31.32,10.47 U2.2 U2.4
  Bottom 0.254: v26.67,41.66 26.42,41.91 JP1.1
  Bottom 0.61: v30.48,24.38 30.23,24.13 v21.34,24.13
+5V
  Top 0.813: JP5.4 36.07,8.13 35.81,8.24 FB1.1
  Bottom 0.406: U$36.5V JP5.4
GND  (via drill 0.4)
  Top 0.254: C6.2 36.01,14.54 R1.1
  Top 0.406: U$36.GND 26.42,49.28 42.67,49.28 43.69,48.26 43.69,45.97 44.2,45.47 61.21,45.47 63.75,42.93 63.75,37.59 61.34,35.18 61.34,25.27 62.87,23.75 64.52,23.75 U$36.GND@3
  Top 0.5: U1.37 16.6,16.37 v16.65,16.42 16.6,16.47 U1.40 | U1.38 v19.25,16.42 U1.41 | U1.39 21.9,16.37 v21.85,16.42 21.9,16.47 U1.42 | 21.85,25.42 v21.15,26.12 | U1.25 17.45,25.14 C4.2 | U1.22 v21.05,20.82 | U1.1 v13.85,12.22 U1.36 | U1.34 v13.85,14.62 | U1.33 v13.85,15.82 | U1.32 v13.85,17.02 | U1.31 v13.85,18.22 | U1.43 12,8.87 v11.95,8.82 | L2.1 v6.3,15.66 | L1.1 v6.3,18.39
  Top 0.61: CN2.MT1 3.12,47.45 7.62,47.45 | CN2.MT2 2.21,35.51 3.05,35.51 10.87,35.51 10.92,35.56 13.61,35.56 v14.24,36.19 | CN2.6 2.98,44.2 2.97,44.2
  Top 0.813: CN2.MT1 2.97,44.2 2.97,35.59 3.05,35.51
  other vias: 10.35,14.42 9.15,14.42 10.35,12.42 7.25,11.12 7.05,9.62 9.25,11.12 9.25,9.92 8.85,8.52 5.8,12.32 4.5,12.62 3.5,13.42 3,14.62 5.3,14.52 5.17,17.19 6.44,17.12 2.18,6.89 4.85,5.62 2.25,9.62 7.85,7.62 6.65,7.22 11.95,24.12 17.05,27.32 18.35,27.32 13.99,41.4 6.82,14.52 2.76,16.99 29.03,28.92 34.43,16.04 34.43,18.07 23.43,43.83 9.11,19.91 9.11,23.21 9.11,24.74 9.11,26.01 9.11,21.56 7.59,18.39 8.98,18.64 9.11,27.53 9.11,28.8 9.11,30.2
  pour Bottom: 44.7,-0.01 44.7,7.37 38.86,7.37 38.86,18.8 31.11,18.8 31.5,53.47 9.18,53.55 8.92,18.65 0.25,18.65 0.21,-0.13
  pour Top (isolate 0.254): 0.25,18.65 8.92,18.65 8.97,53.32 31.5,53.47 31.11,18.8 38.86,18.8 38.86,7.37 44.66,7.37 44.66,-0.11 0.25,0.05
N$1
  Top 0.508: C1.2 4,18.64 | L1.2 X1.FEED
  Top 0.584: 4,18.64 arc90 L1.2
N$2
  Top 0.508: C2.1 5.5,13.42 arc-90 4,14.92 L2.2 | L2.2 3.99,16.64
  Top 0.584: L2.2 arc90 L2.2 | 3.99,16.64 arc-90 C1.1
N$3
  Top 0.508: C3.2 8.25,9.92 arc-90 6.75,8.42 U$35.P$3
N$4
  Top 0.508: U1.35 C2.2 C3.1
N$5  (via drill 0.4)
  Top 0.25: U1.5 18.65,12.02 18.35,12.32 v17.45,12.32
  Bottom 0.25: v17.45,12.32 18.89,12.32 SJ1.2
N$6  (via drill 0.5)
  Top 0.25: U1.7 21.05,11.82 21.45,12.22
  Top 0.254: 21.45,12.22 21.68,12.19 v22.1,12.19
  Bottom 0.25: 20.72,12.22 SJ1.1
  Bottom 0.254: v22.1,12.19 22.08,12.42 SJ1.1
N$7
  Bottom 0.406: U$36.SCL JP3.1
N$8
  Bottom 0.406: U$36.SDA JP3.2
N$9
  Top 0.813: FB1.2 33.86,10.58 U2.3 33.9,10.65 C6.1
N$10
  Bottom 0.406: U$36.AREF JP3.3
N$11
  Top 0.254: SW1.B' SW1.B 8.73,0.99 12.32,4.57 30.99,4.57 U$36.RESET
  Bottom 0.406: U$36.RESET JP5.6
N$12
  Top 0.254: U1.13 28.09,14.62 28.83,15.37 28.83,18.16 28.96,18.29 28.96,26.16 29.97,27.18 29.97,35.18 28.96,36.2 28.96,37.59 28.7,37.85 IC1.2
N$13  (via drill 1.1 pad 1.93)
  other vias: 38.1,25.4
N$14  (via drill 1.1 pad 1.93)
  other vias: 38.1,30.48
N$15  (via drill 1.1 pad 1.93)
  other vias: 40.64,33.02
N$16
  Bottom 0.406: U$36.D9 JP3.9
N$17
  Bottom 0.406: U$36.D8 JP3.10
N$18
  Bottom 0.406: U$36.D7 JP4.1
N$19
  Bottom 0.406: U$36.D6 JP4.2
N$20  (via drill 1.1 pad 1.93)
  other vias: 40.64,30.48
N$21  (via drill 1.1 pad 1.93)
  other vias: 40.64,25.4
N$22  (via drill 1.1 pad 1.93)
  other vias: 40.64,20.32
N$23
  Bottom 0.406: U$36.D2 JP4.6
N$24
  Bottom 0.406: U$36.D1 JP4.7
N$25
  Bottom 0.406: U$36.D0 JP4.8
N$26
  Bottom 0.406: U$36.VIN JP5.1
N$27
  Bottom 0.406: U$36.3V JP5.5
N$28  (via drill 1.1 pad 1.93)
  other vias: 40.64,22.86
N$29
  Bottom 0.406: U$36.IOREF JP5.7
N$30
  Bottom 0.406: U$36.RESERVED JP5.8
N$31
  Bottom 0.406: U$36.A5 JP6.1
N$32
  Bottom 0.406: U$36.A4 JP6.2
N$33
  Bottom 0.406: U$36.A3 JP6.3
N$34
  Bottom 0.406: U$36.A2 JP6.4
N$35
  Bottom 0.406: U$36.A1 JP6.5
N$36
  Bottom 0.406: U$36.A0 JP6.6
N$37  (via drill 1.1 pad 1.93)
  other vias: 40.64,17.78
N$38  (via drill 1.1 pad 1.93)
  other vias: 43.18,20.32
N$39  (via drill 1.1 pad 1.93)
  other vias: 43.18,22.86
N$40  (via drill 1.1 pad 1.93)
  other vias: 43.18,25.4
N$41  (via drill 1.1 pad 1.93)
  other vias: 43.18,27.94
N$42  (via drill 1.1 pad 1.93)
  other vias: 43.18,30.48
N$43  (via drill 1.1 pad 1.93)
  other vias: 45.72,17.78
N$44  (via drill 1.1 pad 1.93)
  other vias: 45.72,20.32
N$45  (via drill 1.1 pad 1.93)
  other vias: 45.72,22.86
N$46  (via drill 1.1 pad 1.93)
  other vias: 45.72,25.4
N$47  (via drill 1.1 pad 1.93)
  other vias: 45.72,27.94
N$48  (via drill 1.1 pad 1.93)
  other vias: 45.72,30.48
N$49  (via drill 1.1 pad 1.93)
  other vias: 58.42,35.56
N$52  (via drill 1.1 pad 1.93)
  other vias: 38.1,22.86
N$53
  Top 0.254: LED1.C 37.97,16.16 R1.2
N$54  (via drill 1.1 pad 1.93)
  other vias: 40.64,15.24
N$55  (via drill 1.1 pad 1.93)
  other vias: 43.18,15.24
N$56  (via drill 1.1 pad 1.93)
  other vias: 48.26,30.48
N$57  (via drill 1.1 pad 1.93)
  other vias: 48.26,27.94
N$58  (via drill 1.1 pad 1.93)
  other vias: 48.26,25.4
N$59  (via drill 1.1 pad 1.93)
  other vias: 48.26,22.86
N$60  (via drill 1.1 pad 1.93)
  other vias: 48.26,20.32
N$61  (via drill 1.1 pad 1.93)
  other vias: 48.26,17.78
N$62  (via drill 1.1 pad 1.93)
  other vias: 38.1,27.94
N$63  (via drill 1.1 pad 1.93)
  other vias: 40.64,27.94
N$64  (via drill 1.1 pad 1.93)
  other vias: 55.88,33.02
N$65  (via drill 1.1 pad 1.93)
  other vias: 53.34,35.56
N$66  (via drill 1.1 pad 1.93)
  other vias: 50.8,17.78
N$67  (via drill 1.1 pad 1.93)
  other vias: 50.8,20.32
N$68  (via drill 1.1 pad 1.93)
  other vias: 50.8,22.86
N$69  (via drill 1.1 pad 1.93)
  other vias: 50.8,25.4
N$70  (via drill 1.1 pad 1.93)
  other vias: 50.8,27.94
N$71  (via drill 1.1 pad 1.93)
  other vias: 50.8,30.48
N$72  (via drill 1.1 pad 1.93)
  other vias: 43.18,33.02
N$73  (via drill 1.1 pad 1.93)
  other vias: 45.72,35.56
N$74  (via drill 1.1 pad 1.93)
  other vias: 45.72,33.02
N$75  (via drill 1.1 pad 1.93)
  other vias: 48.26,35.56
N$76  (via drill 1.1 pad 1.93)
  other vias: 48.26,33.02
N$77  (via drill 1.1 pad 1.93)
  other vias: 50.8,33.02
N$78  (via drill 1.1 pad 1.93)
  other vias: 53.34,17.78
N$79  (via drill 1.1 pad 1.93)
  other vias: 53.34,20.32
N$80  (via drill 1.1 pad 1.93)
  other vias: 53.34,22.86
N$81  (via drill 1.1 pad 1.93)
  other vias: 53.34,25.4
N$82  (via drill 1.1 pad 1.93)
  other vias: 53.34,27.94
N$83  (via drill 1.1 pad 1.93)
  other vias: 53.34,30.48
N$84  (via drill 1.1 pad 1.93)
  other vias: 53.34,33.02
N$85  (via drill 1.1 pad 1.93)
  other vias: 50.8,35.56
N$86  (via drill 1.1 pad 1.93)
  other vias: 43.18,35.56
N$87  (via drill 1.1 pad 1.93)
  other vias: 38.1,35.56
N$88  (via drill 1.1 pad 1.93)
  other vias: 38.1,33.02
N$91  (via drill 1.1 pad 1.93)
  other vias: 55.88,35.56
N$92  (via drill 1.1 pad 1.93)
  other vias: 55.88,30.48
N$93  (via drill 1.1 pad 1.93)
  other vias: 55.88,27.94
N$94  (via drill 1.1 pad 1.93)
  other vias: 55.88,25.4
N$95  (via drill 1.1 pad 1.93)
  other vias: 55.88,22.86
N$96  (via drill 1.1 pad 1.93)
  other vias: 55.88,20.32
N$97  (via drill 1.1 pad 1.93)
  other vias: 55.88,17.78
N$98  (via drill 1.1 pad 1.93)
  other vias: 60.96,20.32
N$99  (via drill 1.1 pad 1.93)
  other vias: 60.96,17.78
N$102  (via drill 1.1 pad 1.93)
  other vias: 58.42,17.78
N$103  (via drill 1.1 pad 1.93)
  other vias: 58.42,20.32
N$104  (via drill 1.1 pad 1.93)
  other vias: 58.42,22.86
N$105  (via drill 1.1 pad 1.93)
  other vias: 58.42,25.4
N$106  (via drill 1.1 pad 1.93)
  other vias: 58.42,27.94
N$107  (via drill 1.1 pad 1.93)
  other vias: 58.42,30.48
N$108  (via drill 1.1 pad 1.93)
  other vias: 58.42,15.24
N$109  (via drill 1.1 pad 1.93)
  other vias: 58.42,33.02
N$110  (via drill 1.1 pad 1.93)
  other vias: 45.72,15.24
N$111  (via drill 1.2 pad 1.93)
  other vias: 38.1,20.32
N$112  (via drill 1.1 pad 1.93)
  other vias: 48.26,15.24
N$113  (via drill 1.1 pad 1.93)
  other vias: 50.8,15.24
N$114  (via drill 1.1 pad 1.93)
  other vias: 53.34,15.24
N$115  (via drill 1.1 pad 1.93)
  other vias: 55.88,15.24
N$116  (via drill 1.1 pad 1.93)
  other vias: 60.96,15.24
N$117  (via drill 1.1 pad 1.93)
  other vias: 40.64,35.56
N$118  (via drill 1.1 pad 1.93)
  other vias: 48.26,40.64
N$119  (via drill 1.1 pad 1.93)
  other vias: 50.8,40.64
N$120  (via drill 1.1 pad 1.93)
  other vias: 43.18,12.7
N$121  (via drill 1.1 pad 1.93)
  other vias: 45.72,12.7
N$122  (via drill 1.1 pad 1.93)
  other vias: 48.26,12.7
N$123  (via drill 1.1 pad 1.93)
  other vias: 50.8,12.7
N$124  (via drill 1.1 pad 1.93)
  other vias: 53.34,12.7
N$125  (via drill 1.1 pad 1.93)
  other vias: 55.88,12.7
N$126  (via drill 1.1 pad 1.93)
  other vias: 58.42,12.7
N$127  (via drill 1.1 pad 1.93)
  other vias: 60.96,12.7
N$128  (via drill 1.1 pad 1.93)
  other vias: 58.42,10.16
N$129  (via drill 1.1 pad 1.93)
  other vias: 55.88,10.16
N$130  (via drill 1.1 pad 1.93)
  other vias: 53.34,10.16
N$131  (via drill 1.1 pad 1.93)
  other vias: 50.8,10.16
N$132  (via drill 1.1 pad 1.93)
  other vias: 48.26,10.16
N$133  (via drill 1.1 pad 1.93)
  other vias: 53.34,40.64
N$134  (via drill 1.1 pad 1.93)
  other vias: 55.88,40.64
N$135  (via drill 1.1 pad 1.93)
  other vias: 58.42,40.64
N$136  (via drill 1.1 pad 1.93)
  other vias: 43.18,38.1
N$138  (via drill 1.1 pad 1.93)
  other vias: 35.56,35.56
N$139  (via drill 1.1 pad 1.93)
  other vias: 35.56,33.02
N$140  (via drill 1.1 pad 1.93)
  other vias: 35.56,30.48
N$141  (via drill 1.1 pad 1.93)
  other vias: 35.56,27.94
N$142  (via drill 1.1 pad 1.93)
  other vias: 35.56,25.4
N$143  (via drill 1.1 pad 1.93)
  other vias: 35.56,22.86
N$144  (via drill 1.1 pad 1.93)
  other vias: 35.56,20.32
N$145  (via drill 1.1 pad 1.93)
  other vias: 63.5,20.32
N$146  (via drill 1.1 pad 1.93)
  other vias: 66.04,20.32
N$147  (via drill 1.1 pad 1.93)
  other vias: 66.04,17.78
N$148  (via drill 1.1 pad 1.93)
  other vias: 45.72,10.16
N$149  (via drill 1.1 pad 1.93)
  other vias: 45.72,38.1
N$150  (via drill 1.1 pad 1.93)
  other vias: 63.5,17.78
N$151  (via drill 1.1 pad 1.93)
  other vias: 63.5,15.24
N$152  (via drill 1.1 pad 1.93)
  other vias: 66.04,15.24
N$153  (via drill 1.1 pad 1.93)
  other vias: 66.04,12.7
N$154  (via drill 1.1 pad 1.93)
  other vias: 63.5,12.7
N$155  (via drill 1.1 pad 1.93)
  other vias: 43.18,10.16
N$156  (via drill 1.1 pad 1.93)
  other vias: 43.18,17.78
N$157  (via drill 1.1 pad 1.93)
  other vias: 60.96,10.16
N$158  (via drill 1.1 pad 1.93)
  other vias: 48.26,38.1
N$159  (via drill 1.1 pad 1.93)
  other vias: 63.5,10.16
N$160  (via drill 1.1 pad 1.93)
  other vias: 50.8,38.1
N$161
  Bottom 0.254: SJ2.1 64.9,38.99 63.75,37.85 63.75,33.66 64.52,32.89 66.93,32.89 67.44,32.38 67.44,28.32 67.06,27.94 U$36.MOSI
N$162  (via drill 1.1 pad 1.93)
  other vias: 53.34,38.1
N$163  (via drill 0.5)
  Top 0.254: v62.74,33.78 62.74,32.77 61.98,32 61.98,28.83 62.87,27.94 U$36.SCK
  Bottom 0.254: SJ4.1 62.61,33.91 v62.74,33.78
N$164
  Bottom 0.254: SJ3.1 60.33,33.78 U$36.MISO
N$166  (via drill 1.1 pad 1.93)
  other vias: 55.88,38.1
N$167  (via drill 1.1 pad 1.93)
  other vias: 58.42,38.1
N$173  (via drill 1.1 pad 1.93)
  other vias: 33.02,38.1
N$174  (via drill 1.1 pad 1.93)
  other vias: 33.02,35.56
N$175  (via drill 1.1 pad 1.93)
  other vias: 33.02,33.02
N$176  (via drill 1.1 pad 1.93)
  other vias: 38.1,38.1
N$177  (via drill 1.1 pad 1.93)
  other vias: 40.64,38.1
N$178  (via drill 1.1 pad 1.93)
  other vias: 33.02,30.48
N$179  (via drill 1.1 pad 1.93)
  other vias: 33.02,27.94
N$180  (via drill 1.1 pad 1.93)
  other vias: 33.02,25.4
N$181  (via drill 1.1 pad 1.93)
  other vias: 33.02,22.86
N$182  (via drill 1.1 pad 1.93)
  other vias: 33.02,20.32
N$187  (via drill 1.1 pad 1.93)
  other vias: 40.64,12.7
N$188  (via drill 1.1 pad 1.93)
  other vias: 40.64,10.16
N$193  (via drill 1.1 pad 1.93)
  other vias: 35.56,38.1
RXD_3V
  Top 0.254: U1.8 JP2.2
SCL_3V  (via drill 0.4)
  Top 0.25: U1.29 11.05,20.62 10.85,20.42 10.85,19.62 11.05,19.42 U1.30 v13.95,19.42
  Bottom 0.25: v13.95,19.42 14.85,19.42 15.35,19.92 TP1.P$1
SD_CS_3V
  Top 0.305: 19.98,36.32 U3.4 19.01,36.36 18.41,36.96 | 18.03,37.34 18.41,36.96 | CN2.2 11.5,39.8 11.94,39.37 13.21,38.1 17.27,38.1 18.41,36.96
SD_CS_5V  (via drill 0.5)
  Top 0.305: U3.5 18.76,35.09 v17.53,36.32 | v27.56,45.59 42.55,45.59 JP1.8
  Bottom 0.254: 44.07,43.94 JP1.8 50.16,43.94 JP4.4
  Bottom 0.305: v17.53,36.32 17.53,41.91 21.08,45.47 27.43,45.47 v27.56,45.59
  Bottom 0.406: U$36.D4 JP4.4
SDA_3V  (via drill 0.4)
  Top 0.25: U1.27 15.05,23.12 14.85,23.32 14.05,23.32 13.85,23.12 U1.28 13.85,20.82 v13.95,20.72
  Bottom 0.25: TP2.P$1 18.75,20.92 18.55,21.12 14.35,21.12 v13.95,20.72
SPI_CLK_3V  (via drill 0.5)
  Top 0.305: U1.17 27.04,19.42 27.69,20.07 27.69,22.86 26.92,23.62 26.92,25.65 27.43,26.16 27.43,31.88 26.92,32.51 | 26.92,32.51 25.26,32.51 U3.10 | CN2.5 5.9,43.13 v10.92,43.13 | v27.18,32.51 26.92,32.51
  Bottom 0.305: v27.18,32.51 12.19,32.51 10.92,33.78 v10.92,43.13
SPI_CLK_5V  (via drill 0.5)
  Top 0.305: U3.9 25.15,31.21 v25.15,30.23
  Bottom 0.254: U$36.D13 28.96,52.07 29.72,52.83 62.23,52.83 62.23,44.96 SJ4.2
  Bottom 0.305: v25.15,30.23 27.43,30.23 28.96,31.75 28.96,40.64 29.21,40.89 29.21,42.16 28.83,42.55 JP1.2 JP3.5
  Bottom 0.406: U$36.D13 JP3.5
SPI_CS_3V
  Top 0.254: 25.26,38.86 25.32,38.8 IC1.1 28.77,38.8 29.46,38.1 29.46,36.45 30.48,35.43 30.48,26.92 29.46,25.91
  Top 0.305: U1.12 27.9,13.42 29.34,14.86 29.34,17.91 29.46,18.03 29.46,25.91 | 25.26,38.86 U3.15
SPI_CS_5V  (via drill 0.5)
  Top 0.305: U3.14 24.09,37.63 23.75,37.97 | 23.75,37.97 23.62,38.1 23.62,41.15 25.15,42.67 v32.77,42.67 | R3.2 26.11,28.7 23.62,28.7 23.37,28.96 23.37,37.59 23.75,37.97
  Bottom 0.305: JP3.8 JP1.5 35.31,42.67 v32.77,42.67
  Bottom 0.406: U$36.D10 JP3.8
SPI_IRQ_3V  (via drill 0.5)
  Top 0.305: U1.14 27.76,15.82 v27.94,16
  Bottom 0.254: 42.04,42.55 52.2,42.55 55.88,46.23
  Bottom 0.305: v27.94,16 31.5,19.05 31.5,38.86 34.29,41.66 40.39,41.66 41.66,42.93 | 55.88,46.23 JP4.5 | 41.66,42.93 JP1.7 | 42.04,42.55 41.66,42.93
  Bottom 0.406: U$36.D3 JP4.5
SPI_MISO_3V  (via drill 0.39)
  Top 0.254: IC1.4 30.55,36.9 31.5,37.85 31.5,39.37 v30.99,39.88
  Top 0.305: JP3.6 31.5,48.26 31.24,48.51 11.94,48.51 8.73,45.3 CN2.7
  Bottom 0.254: v30.99,39.88 31.5,40.39 JP1.3 | U$36.D12 32.89,52.2 59.69,52.2 59.69,45.21 SJ3.2
  Bottom 0.305: JP1.3 JP3.6
  Bottom 0.406: U$36.D12 JP3.6
SPI_MOSI_3V  (via drill 0.5)
  Top 0.254: 28.45,18.8 27.56,17.91 27.56,17.4 27.18,17.02
  Top 0.305: U1.15 27.18,17.02 | 28.45,18.8 28.45,23.11 27.69,23.88 27.69,25.4 28.07,25.78 28.07,34.42 27.39,35.09 U3.12 27.47,35.09 v27.18,35.31 | CN2.3 5.93,40.85 v12.19,40.85
  Bottom 0.305: v12.19,40.85 12.19,35.05 12.95,34.29 26.16,34.29 v27.18,35.31
SPI_MOSI_5V  (via drill 0.5)
  Top 0.254: U$36.D11 35.69,52.45 63.75,52.45 65.28,50.93 65.28,49.28 v65.02,49.02
  Top 0.305: U3.11 27.14,33.82 v27.18,33.78 | v28.19,41.4 28.57,41.78 33.66,41.78 34.04,42.16 JP1.4
  Bottom 0.254: v65.02,49.02 65.02,44.7 SJ2.2
  Bottom 0.305: v27.18,33.78 27.69,33.78 28.19,34.29 v28.19,41.4 | JP1.4 JP3.7
  Bottom 0.406: U$36.D11 JP3.7
TXD_3V
  Top 0.25: U1.6 19.85,7.85 JP2.1
VBAT_EN_3V  (via drill 0.4)
  Top 0.21: v16.25,24.82 U1.26
  Top 0.305: U3.6 16.8,33.82 15.75,32.77 15.75,25.33 v16.25,24.82
VBAT_EN_5V  (via drill 0.5)
  Top 0.305: U3.7 17.76,32.55 R2.2 16.84,32.33 16.51,32 16.51,28.96 v16.76,28.7 | v30.48,40.89 30.73,41.15 36.32,41.15 JP1.6
  Bottom 0.305: v16.76,28.7 26.92,28.7 29.72,31.5 29.72,40.13 v30.48,40.89 | JP1.6 40.77,45.59 49.4,45.59 JP4.3
  Bottom 0.406: U$36.D5 JP4.3

### Text on the board
tPlace: WEN | CCS | IRQ | 3V | CLK | MISO | MOSI | WCS | WEN | IRQ | CCS | ICSP | v1 | CC3000 | 802.11b/g | Adafruit / / WiFi Shield | Power | TXD | RXD | GND | Debug
bPlace: MISO | SCK | MOSI